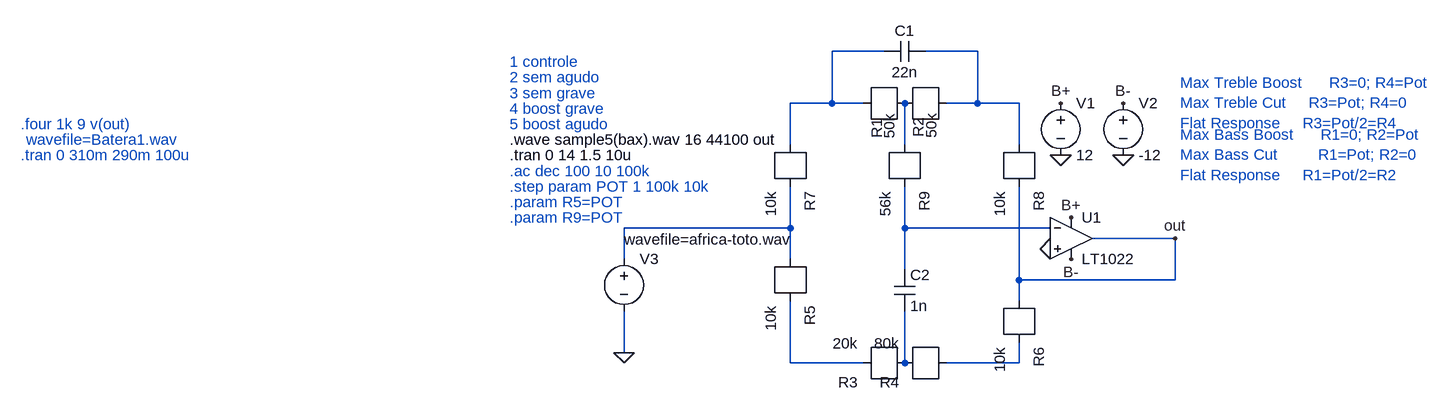
[diagram p0: schematic filtro ativo baxandall 04.asc]
filtro ativo baxandall 04.asc, the LTspice schematic file:
Version 4
SHEET 1 1216 1344
WIRE 112 128 32 128
WIRE 256 128 176 128
WIRE 32 208 32 128
WIRE 32 208 -32 208
WIRE 80 208 32 208
WIRE 256 208 256 128
WIRE 256 208 208 208
WIRE 320 208 256 208
WIRE -32 272 -32 208
WIRE 144 272 144 208
WIRE 320 272 320 208
WIRE -32 400 -32 336
WIRE -32 400 -288 400
WIRE 144 400 144 336
WIRE 368 400 144 400
WIRE 560 416 432 416
WIRE -288 448 -288 400
WIRE -32 448 -32 400
WIRE 144 464 144 400
WIRE 320 480 320 336
WIRE 560 480 560 416
WIRE 560 480 320 480
WIRE 320 512 320 480
WIRE -288 592 -288 528
WIRE -32 608 -32 512
WIRE 80 608 -32 608
WIRE 144 608 144 528
WIRE 320 608 320 576
WIRE 320 608 208 608
FLAG 368 432 0
FLAG 480 288 0
FLAG 384 288 0
FLAG 384 208 B+
FLAG 480 208 B-
FLAG 400 384 B+
FLAG 400 448 B-
FLAG -288 592 0
FLAG 560 416 out
SYMBOL r 144 208 R180
WINDOW 0 43 -54 VRight 2
WINDOW 3 24 -55 VRight 2
SYMATTR InstName R1
SYMATTR Value 50k
SYMBOL r 208 208 R180
WINDOW 0 43 -53 VRight 2
WINDOW 3 23 -54 VRight 2
SYMATTR InstName R2
SYMATTR Value 50k
SYMBOL r 144 608 R180
SYMATTR InstName R3
SYMATTR Value 20k
SYMBOL r 208 608 R180
SYMATTR InstName R4
SYMATTR Value 80k
SYMBOL r -32 448 R90
SYMATTR InstName R5
SYMATTR Value 10k
SYMBOL r 320 512 R90
SYMATTR InstName R6
SYMATTR Value 10k
SYMBOL r -32 272 R90
SYMATTR InstName R7
SYMATTR Value 10k
SYMBOL r 320 272 R90
SYMATTR InstName R8
SYMATTR Value 10k
SYMBOL r 144 272 R90
SYMATTR InstName R9
SYMATTR Value 56k
SYMBOL cap 176 112 R90
WINDOW 0 0 32 VBottom 2
WINDOW 3 32 32 VTop 2
SYMATTR InstName C1
SYMATTR Value 22n
SYMBOL cap 128 464 R0
SYMATTR InstName C2
SYMATTR Value 1n
SYMBOL voltage -288 432 R0
WINDOW 3 0 -14 Left 2
SYMATTR Value wavefile=africa-toto.wav
SYMATTR InstName V3
SYMBOL voltage 384 192 R0
SYMATTR InstName V1
SYMATTR Value 12
SYMBOL voltage 480 192 R0
SYMATTR InstName V2
SYMATTR Value -12
SYMBOL opamps/LT1022 400 352 R0
SYMATTR InstName U1
TEXT -464 312 Left 2 ;.ac dec 100 10 100k
TEXT -1216 240 Left 2 ;.four 1k 9 v(out)
TEXT -464 288 Left 2 !.tran 0 14 1.5 10u
TEXT -464 336 Left 2 ;.step param POT 1 100k 10k
TEXT -464 360 Left 2 ;.param R5=POT
TEXT -464 384 Left 2 ;.param R9=POT
TEXT -1208 264 Left 2 ;wavefile=Batera1.wav
TEXT -1216 288 Left 2 ;.tran 0 310m 290m 100u
TEXT 568 256 Left 2 ;Max Bass Boost  	R1=0; R2=Pot\nMax Bass Cut 		R1=Pot; R2=0\nFlat Response 	R1=Pot/2=R2
TEXT 568 176 Left 2 ;Max Treble Boost  	R3=0; R4=Pot\nMax Treble Cut 	R3=Pot; R4=0\nFlat Response 	R3=Pot/2=R4
TEXT -464 264 Left 2 !.wave sample5(bax).wav 16 44100 out
TEXT -464 192 Left 2 ;3 sem grave
TEXT -464 168 Left 2 ;2 sem agudo
TEXT -464 216 Left 2 ;4 boost grave
TEXT -464 144 Left 2 ;1 controle
TEXT -464 240 Left 2 ;5 boost agudo

The netlist it stands for:
* filtro ativo baxandall 04.asc
R1 N001 N003 50k
R2 N003 N002 50k
R3 N006 N007 20k
R4 N007 N008 80k
R5 N006 N004 10k
R6 N008 out 10k
R7 N004 N001 10k
R8 out N002 10k
R9 N005 N003 56k
C1 N002 N001 22n
C2 N005 N007 1n
V3 N004 0 wavefile=africa-toto.wav
V1 B+ 0 12
V2 B- 0 -12
XU1 0 N005 B+ B- out LT1022  ; pins In+ In- V+ V- OUT
* .ac dec 100 10 100k
* .four 1k 9 v(out)
.tran 0 14 1.5 10u
* .step param POT 1 100k 10k
* .param R5=POT
* .param R9=POT
* wavefile=Batera1.wav
* .tran 0 310m 290m 100u
* Max Bass Boost  	R1=0; R2=Pot
* Max Bass Cut 		R1=Pot; R2=0
* Flat Response 	R1=Pot/2=R2
* Max Treble Boost  	R3=0; R4=Pot
* Max Treble Cut 	R3=Pot; R4=0
* Flat Response 	R3=Pot/2=R4
.wave sample5(bax).wav 16 44100 out
* 3 sem grave
* 2 sem agudo
* 4 boost grave
* 1 controle
* 5 boost agudo
.backanno
.end